# EasyEDA Pro project uven2-mk3-cc-driver-20x.eprj, schematic Schematic1
Board Name: Board1; Create Date: 2025-05-29; Page Name: P1; Project Name: uven2-mk3-cc-driver-20x; Schematic Name: Schematic1; Update Date: 2025-06-02; Company: EasyEDA.com; Page Size: A4; Version: V1.0
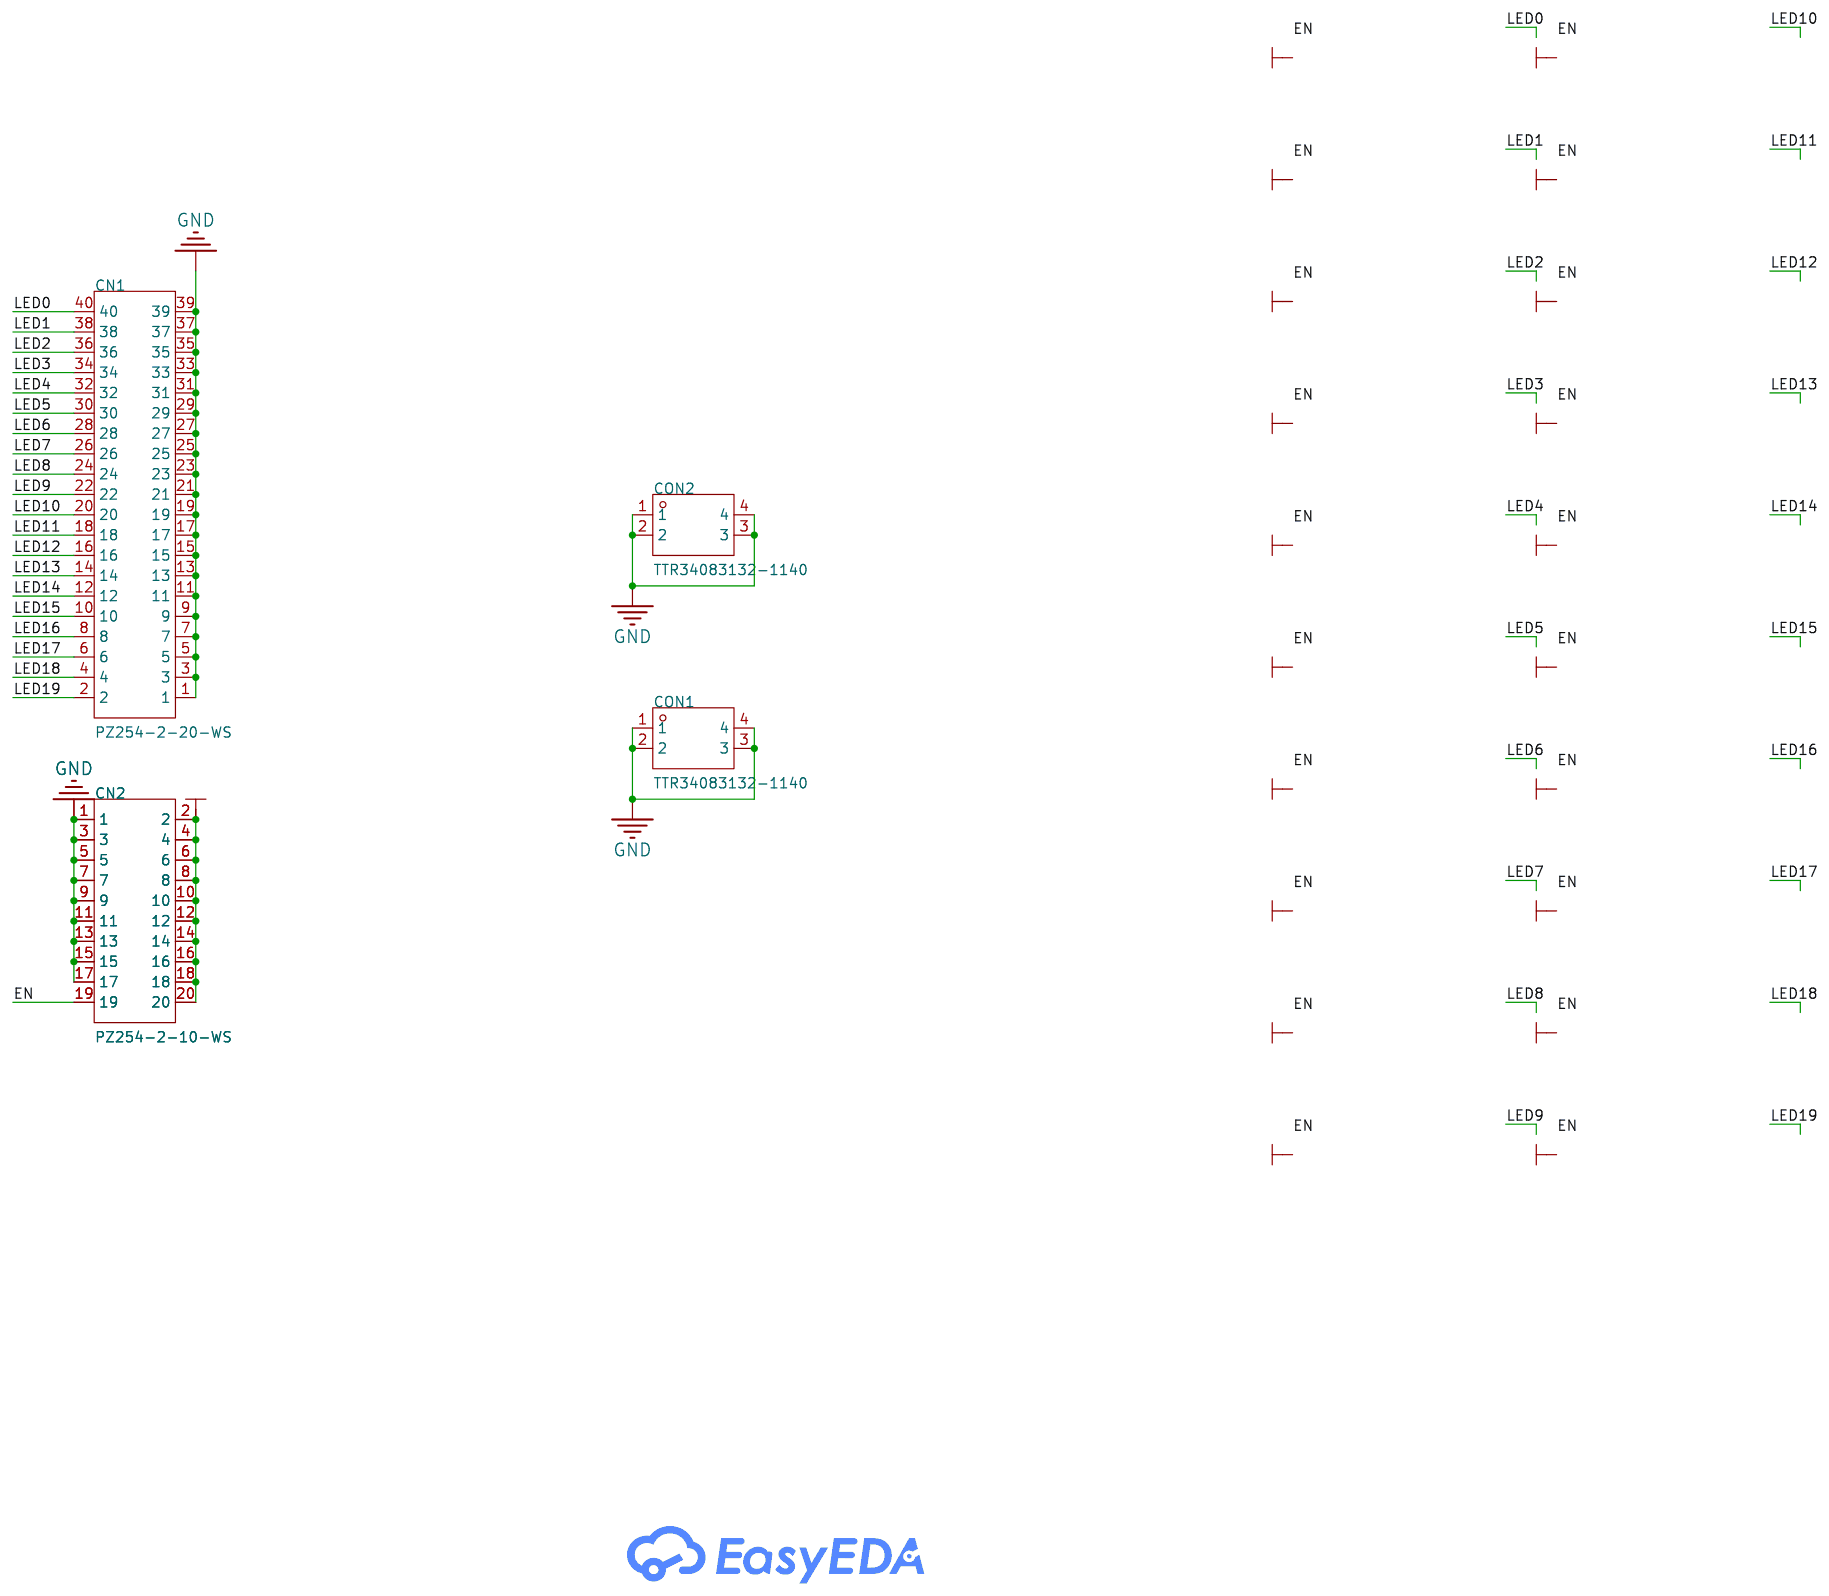
[diagram p1: schematic sheet]

## Parts
CBB1  -
CBB2  -
CBB9  -
CBB10  -
CBB17  -
CBB18  -
CBB25  -
CBB26  -
CBB33  -
CBB34  -
CBB41  -
CBB42  -
CBB49  -
CBB50  -
CBB57  -
CBB58  -
CBB65  -
CBB66  -
CBB73  -
CBB74  -
CN1  PZ254-2-20-WS  [HDR-SMD_40P-P2.54-H-M-R2-C20_L8.5]
CN2  PZ254-2-10-WS  [HDR-SMD_20P-P2.54-H-M-R2-C10_L8.5]
CON1  TTR34083132-1140  [TH-4_L11.4-W8.3_TTR34083132-1140]
CON2  TTR34083132-1140  [TH-4_L11.4-W8.3_TTR34083132-1140]

## Library data of the parts
CN1 = PZ254-2-20-WS: LCSC Part Name: 黑色 2x20P 间距:2.54mm 方针 卧贴; Supplier Part: C5149370; Manufacturer: HCTL(华灿天禄); Supplier Footprint: SMD,P=2.54mm,卧贴; JLCPCB Part Class: Extended Part; Datasheet: https://atta.szlcsc.com/upload/public/pdf/source/20230609/395CF6299CB3DEE695290492722C7F5B.pdf; Supplier: LCSC; Pin Structure: 2x20P; Pitch: 2.54mm; Row Spacing: 2.54mm; Circluar Pins/Square Pins: Policy; Mounting Type: Surface Mount; Number of Rows: Double Row; Number of Pins: 40P; Current Rating: 3A; Length of Mating Pin: 6mm; Insulation Height: 2.5mm; Operating Temperature: -40℃~+105℃; Color: Black
CN2 = PZ254-2-10-WS: LCSC Part Name: 黑色 2x10P 间距:2.54mm 方针 卧贴; Supplier Part: C5149360; Manufacturer: HCTL(华灿天禄); Supplier Footprint: SMD,P=2.54mm,卧贴; JLCPCB Part Class: Extended Part; Datasheet: https://atta.szlcsc.com/upload/public/pdf/source/20230609/395CF6299CB3DEE695290492722C7F5B.pdf; Supplier: LCSC; Pin Structure: 2x10P; Pitch: 2.54mm; Row Spacing: 2.54mm; Circluar Pins/Square Pins: Policy; Mounting Type: Surface Mount; Number of Rows: Double Row; Number of Pins: 20P; Current Rating: 3A; Length of Mating Pin: 6mm; Insulation Height: 2.5mm; Operating Temperature: -40℃~+105℃; Color: Black
CON1 CON2 = TTR34083132-1140: LCSC Part Name: PCB焊接端子铆垫片侧插M3 四脚 8.3*13.2*11.4mm T0.8 镀雾锡; Supplier Part: C19724571; Manufacturer: XFCN(兴飞); Supplier Footprint: 插件; JLCPCB Part Class: Extended Part; Datasheet: https://atta.szlcsc.com/upload/public/pdf/source/20231225/31BFD3AF230794DCA89A7AA8B907237C.pdf; Supplier: LCSC; Screw Hole Size: M3; Number of Leg: 4

## Nets
+12V: CBB1.(ANODE) CBB2.(ANODE) CBB9.(ANODE) CBB10.(ANODE) CBB17.(ANODE) CBB18.(ANODE) CBB25.(ANODE) CBB26.(ANODE) CBB33.(ANODE) CBB34.(ANODE) CBB41.(ANODE) CBB42.(ANODE) CBB49.(ANODE) CBB50.(ANODE) CBB57.(ANODE) CBB58.(ANODE) CBB65.(ANODE) CBB66.(ANODE) CBB73.(ANODE) CBB74.(ANODE) CN1.2 CN1.4 CN1.6 CN1.8 CN1.10 CN1.12 CN1.14 CN1.16 CN1.18 CN1.20 CN1.22 CN1.24 CN1.26 CN1.28 CN1.30 CN1.32 CN1.34 CN1.36 CN1.38 CN1.40 CN2.2 CN2.4 CN2.6 CN2.8 CN2.10 CN2.12 CN2.14 CN2.16 CN2.18 CN2.19 CN2.20
GND: CN1.1 CN1.3 CN1.5 CN1.7 CN1.9 CN1.11 CN1.13 CN1.15 CN1.17 CN1.19 CN1.21 CN1.23 CN1.25 CN1.27 CN1.29 CN1.31 CN1.33 CN1.35 CN1.37 CN1.39 CN2.1 CN2.3 CN2.5 CN2.7 CN2.9 CN2.11 CN2.13 CN2.15 CN2.17 CON1.1 CON1.2 CON1.3 CON1.4 CON2.1 CON2.2 CON2.3 CON2.4
